# Altium schematic sheet port-expander.SchDoc
size A3; DocumentNumber: 36; SheetNumber: 36; SheetTotal: 45; SheetDescription: Port Expander Digital IOs
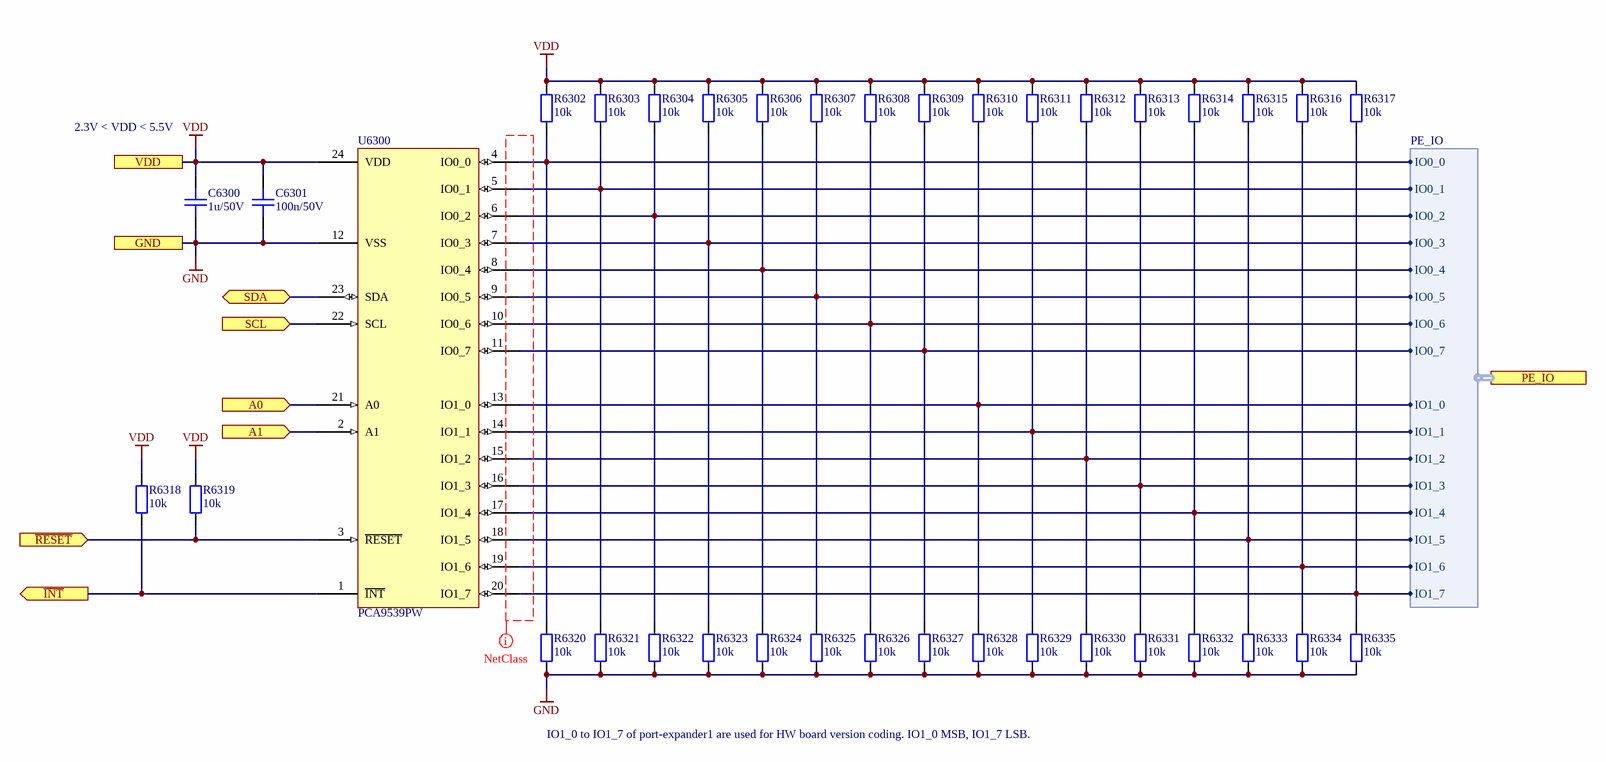
[diagram p0: port-expander.SchDoc]

## Parts
C6300  1u/50V  [CAPC1608X08N]
C6301  100n/50V  [CAPC1005X06N]
R6302  10k  [RESC1005X04N]
R6303  10k  [RESC1005X04N]
R6304  10k  [RESC1005X04N]
R6305  10k  [RESC1005X04N]
R6306  10k  [RESC1005X04N]
R6307  10k  [RESC1005X04N]
R6308  10k  [RESC1005X04N]
R6309  10k  [RESC1005X04N]
R6310  10k  [RESC1005X04N]
R6311  10k  [RESC1005X04N]
R6312  10k  [RESC1005X04N]
R6313  10k  [RESC1005X04N]
R6314  10k  [RESC1005X04N]
R6315  10k  [RESC1005X04N]
R6316  10k  [RESC1005X04N]
R6317  10k  [RESC1005X04N]
R6318  10k  [RESC1005X04N]
R6319  10k  [RESC1005X04N]
R6320  10k  [RESC1005X04N]
R6321  10k  [RESC1005X04N]
R6322  10k  [RESC1005X04N]
R6323  10k  [RESC1005X04N]
R6324  10k  [RESC1005X04N]
R6325  10k  [RESC1005X04N]
R6326  10k  [RESC1005X04N]
R6327  10k  [RESC1005X04N]
R6328  10k  [RESC1005X04N]
R6329  10k  [RESC1005X04N]
R6330  10k  [RESC1005X04N]
R6331  10k  [RESC1005X04N]
R6332  10k  [RESC1005X04N]
R6333  10k  [RESC1005X04N]
R6334  10k  [RESC1005X04N]
R6335  10k  [RESC1005X04N]
U6300  PCA9539PW  [PCA9539PW]

## Ports
A0 (in), A1 (in), GND, PE_IO (harness PE_IO), SCL (in), SDA (bidir), VDD, ~{INT} (out), ~{RESET} (in)

## Harnesses
PE_IO: IO0_0, IO0_1, IO0_2, IO0_3, IO0_4, IO0_5, IO0_6, IO0_7, IO1_0, IO1_1, IO1_2, IO1_3, IO1_4, IO1_5, IO1_6, IO1_7

## Nets
GND: C6300.1 C6301.1 R6320.1 R6321.1 R6322.1 R6323.1 R6324.1 R6325.1 R6326.1 R6327.1 R6328.1 R6329.1 R6330.1 R6331.1 R6332.1 R6333.1 R6334.1 R6335.1 U6300.12(VSS) ; port GND
VDD: C6300.2 C6301.2 R6302.2 R6303.2 R6304.2 R6305.2 R6306.2 R6307.2 R6308.2 R6309.2 R6310.2 R6311.2 R6312.2 R6313.2 R6314.2 R6315.2 R6316.2 R6317.2 R6318.2 R6319.2 U6300.24(VDD) ; port VDD
~{INT}: R6318.1 U6300.1(~{INT}) ; port ~{INT}
~{RESET}: R6319.1 U6300.3(~{RESET}) ; port ~{RESET}
A0: U6300.21(A0) ; port A0
A1: U6300.2(A1) ; port A1
SCL: U6300.22(SCL) ; port SCL
SDA: U6300.23(SDA) ; port SDA
NetR6302_1: R6302.1 R6320.2 U6300.4(IO0_0) ; port PE_IO.IO0_0
NetR6303_1: R6303.1 R6321.2 U6300.5(IO0_1) ; port PE_IO.IO0_1
NetR6304_1: R6304.1 R6322.2 U6300.6(IO0_2) ; port PE_IO.IO0_2
NetR6305_1: R6305.1 R6323.2 U6300.7(IO0_3) ; port PE_IO.IO0_3
NetR6306_1: R6306.1 R6324.2 U6300.8(IO0_4) ; port PE_IO.IO0_4
NetR6307_1: R6307.1 R6325.2 U6300.9(IO0_5) ; port PE_IO.IO0_5
NetR6308_1: R6308.1 R6326.2 U6300.10(IO0_6) ; port PE_IO.IO0_6
NetR6309_1: R6309.1 R6327.2 U6300.11(IO0_7) ; port PE_IO.IO0_7
NetR6310_1: R6310.1 R6328.2 U6300.13(IO1_0) ; port PE_IO.IO1_0
NetR6311_1: R6311.1 R6329.2 U6300.14(IO1_1) ; port PE_IO.IO1_1
NetR6312_1: R6312.1 R6330.2 U6300.15(IO1_2) ; port PE_IO.IO1_2
NetR6313_1: R6313.1 R6331.2 U6300.16(IO1_3) ; port PE_IO.IO1_3
NetR6314_1: R6314.1 R6332.2 U6300.17(IO1_4) ; port PE_IO.IO1_4
NetR6315_1: R6315.1 R6333.2 U6300.18(IO1_5) ; port PE_IO.IO1_5
NetR6316_1: R6316.1 R6334.2 U6300.19(IO1_6) ; port PE_IO.IO1_6
NetR6317_1: R6317.1 R6335.2 U6300.20(IO1_7) ; port PE_IO.IO1_7

## Layout directives
net class PE_IO: (no net found under the mark)

## Notes on the sheet
- 2.3V < VDD < 5.5V
- IO1_0 to IO1_7 of port-expander1 are used for HW board version coding. IO1_0 MSB, IO1_7 LSB.
- Fraunhofer IISB
- Schottkystr. 10
- developed by:
- 91058 Erlangen
- Germany
- Author
- Project
- License
- Description
- File
- Version
- Release Date
- Sheet
- foxbms.org <https://foxbms.org>
- www.iisb.fraunhofer.de <https://www.iisb.fraunhofer.de/>
- foxBMS Team
- /

## Library data of the parts
C6300 = gen_C_ceramic_1u_50V_X7R_0603: MLCC; Capacitance: 1u; Rated Voltage: 50V; Dielectric: X7R; Case EIA: 0603; Case Metric: 1608; Automotive Qualified: False; Tolerance: ± 10%; PnP Package: 0603C; Part Number: gen_C_ceramic_1u_50V_X7R_0603; Operating Temperature: -55°C - +125°C; Supplier 1: Farnell; Supplier Part Number 1: 2779055
C6301 = gen_C_ceramic_100n_50V_X7R_0402: MLCC; Capacitance: 100n; Rated Voltage: 50V; Dielectric: X7R; Case EIA: 0402; Case Metric: 1005; PnP Package: 0402C; PnP Value: 100nF/50V/X7R; PnP equipped: x; Automotive Qualified: True; AEC-Q Norm: AEC-Q200; Part Number: gen_C_ceramic_100n_50V_X7R_0402; Supplier 1: Farnell; Supplier Part Number 1: 2210822; ECCN: EAR99
R6302-R6335 = gen_R_10k_0402: SMD Resistor 10k 0402; Tolerance: 1%; Power: 0.063W; Case EIA: 0402; Case Metric: 1005; Maximum Working Voltage: 50V; PnP Package: 0402R; PnP equipped: x; Automotive Qualified: True; AEC-Q Norm: AEC-Q200; Part Number: gen_R_10k_0402; Operating Temperature: -55°C - +155°C; Resistance: 10k; Series: E24, E96; PnP Value: 10k; Supplier 1: Farnell; Supplier Part Number 1: 2059239; ECCN: EAR99
U6300 = PCA9539PW: 16-bit I2C-bus and SMBus low power I/O port with interrupt and reset; Manufacturer: NXP; Automotive Qualified: False; Part Number: PCA9539PW; Part Name: PCA9539PW; Operating Temperature: −40°C - +125°C; ComponentLink1Description: Datasheet; ComponentLink1URL: https://www.nxp.com/docs/en/data-sheet/PCA9539_PCA9539R.pdf; Supplier 1: Mouser; Supplier Part Number 1: 771-PCA9539PW/Q90011